# Altium schematic sheet connector_valve.SchDoc
size A
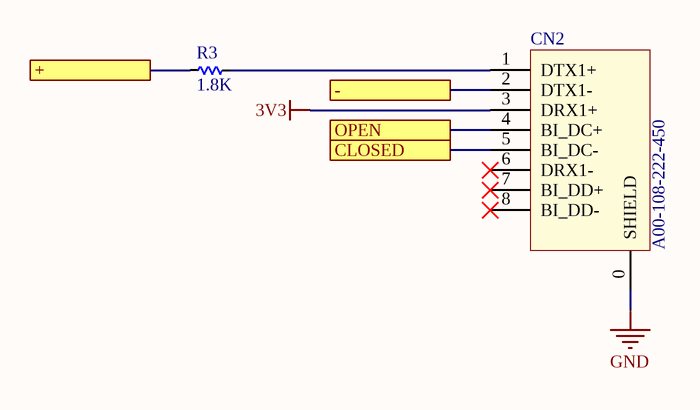
[diagram p0: connector_valve.SchDoc]

## Parts
CN2  MFG P/N: A00-108-222-450  [RJ45 TOP ENTRY EDAC A00-108-222-450]  (hidden comment: CONN_RJ45_TOP_A00-108-222-450)
R3  value 1.8K  [R1206]  (hidden comment: __Template_Resistor)

## Ports
+, -, CLOSED, OPEN

## Nets
3V3: CN2.3(DRX1+)
GND: CN2.0(SHIELD)
+: R3.1 ; port +
-: CN2.2(DTX1-) ; port -
CLOSED: CN2.5(BI_DC-) ; port CLOSED
OPEN: CN2.4(BI_DC+) ; port OPEN
NetCN2_1: CN2.1(DTX1+) R3.2

Not connected (* = marked no-connect by the designer): CN2 6(DRX1-)* 7(BI_DD+)* 8(BI_DD-)*

## Library data of the parts
CN2 = 492: CONN, RJ-45, 1-PORT, 8-POS, VERT, 0.76um GOLD, TH; ID: 492; MFG: EDAC Inc; COMMON: 210-00203-00; XPN: XS-10003929; Status: In Development; RoHS Compliant: Yes; LOON: 210-00203-00; Gecko: 210-00203-00
R3 = 3502: Resistor, 1.80K Ohms, 1206, 0.25W, ±1%; ID: 3502; MFG: YAGEO; MFG P/N: RC1206FR-071K8L; Power: 1/4W; COMMON: 470-06908-00; XPN: XS-10017648; Status: Released; Package: 1206; Tolerance: 1%; Height: 0.65mm; Supplier 1: Digi-Key; LOON: 470-06908-00; Gecko: 470-06908-00; Supplier Part Number 1: 311-1.80KFRCT-ND